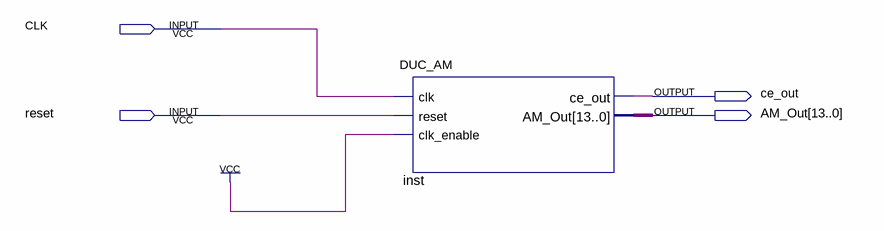
[diagram p0: schematic sheet]
// Quartus schematic top.bdf as structural Verilog: 1 symbols, 4 pins
module top (
  input  CLK,
  input  reset,
  output ce_out,
  output [13:0] AM_Out
);

  DUC_AM inst (.clk(CLK), .reset(reset), .clk_enable(1'b1), .ce_out(ce_out), .AM_Out(AM_Out));
endmodule
